# Altium schematic sheet 10 AV-SPDIF.SchDoc
size 420 x 297 mm
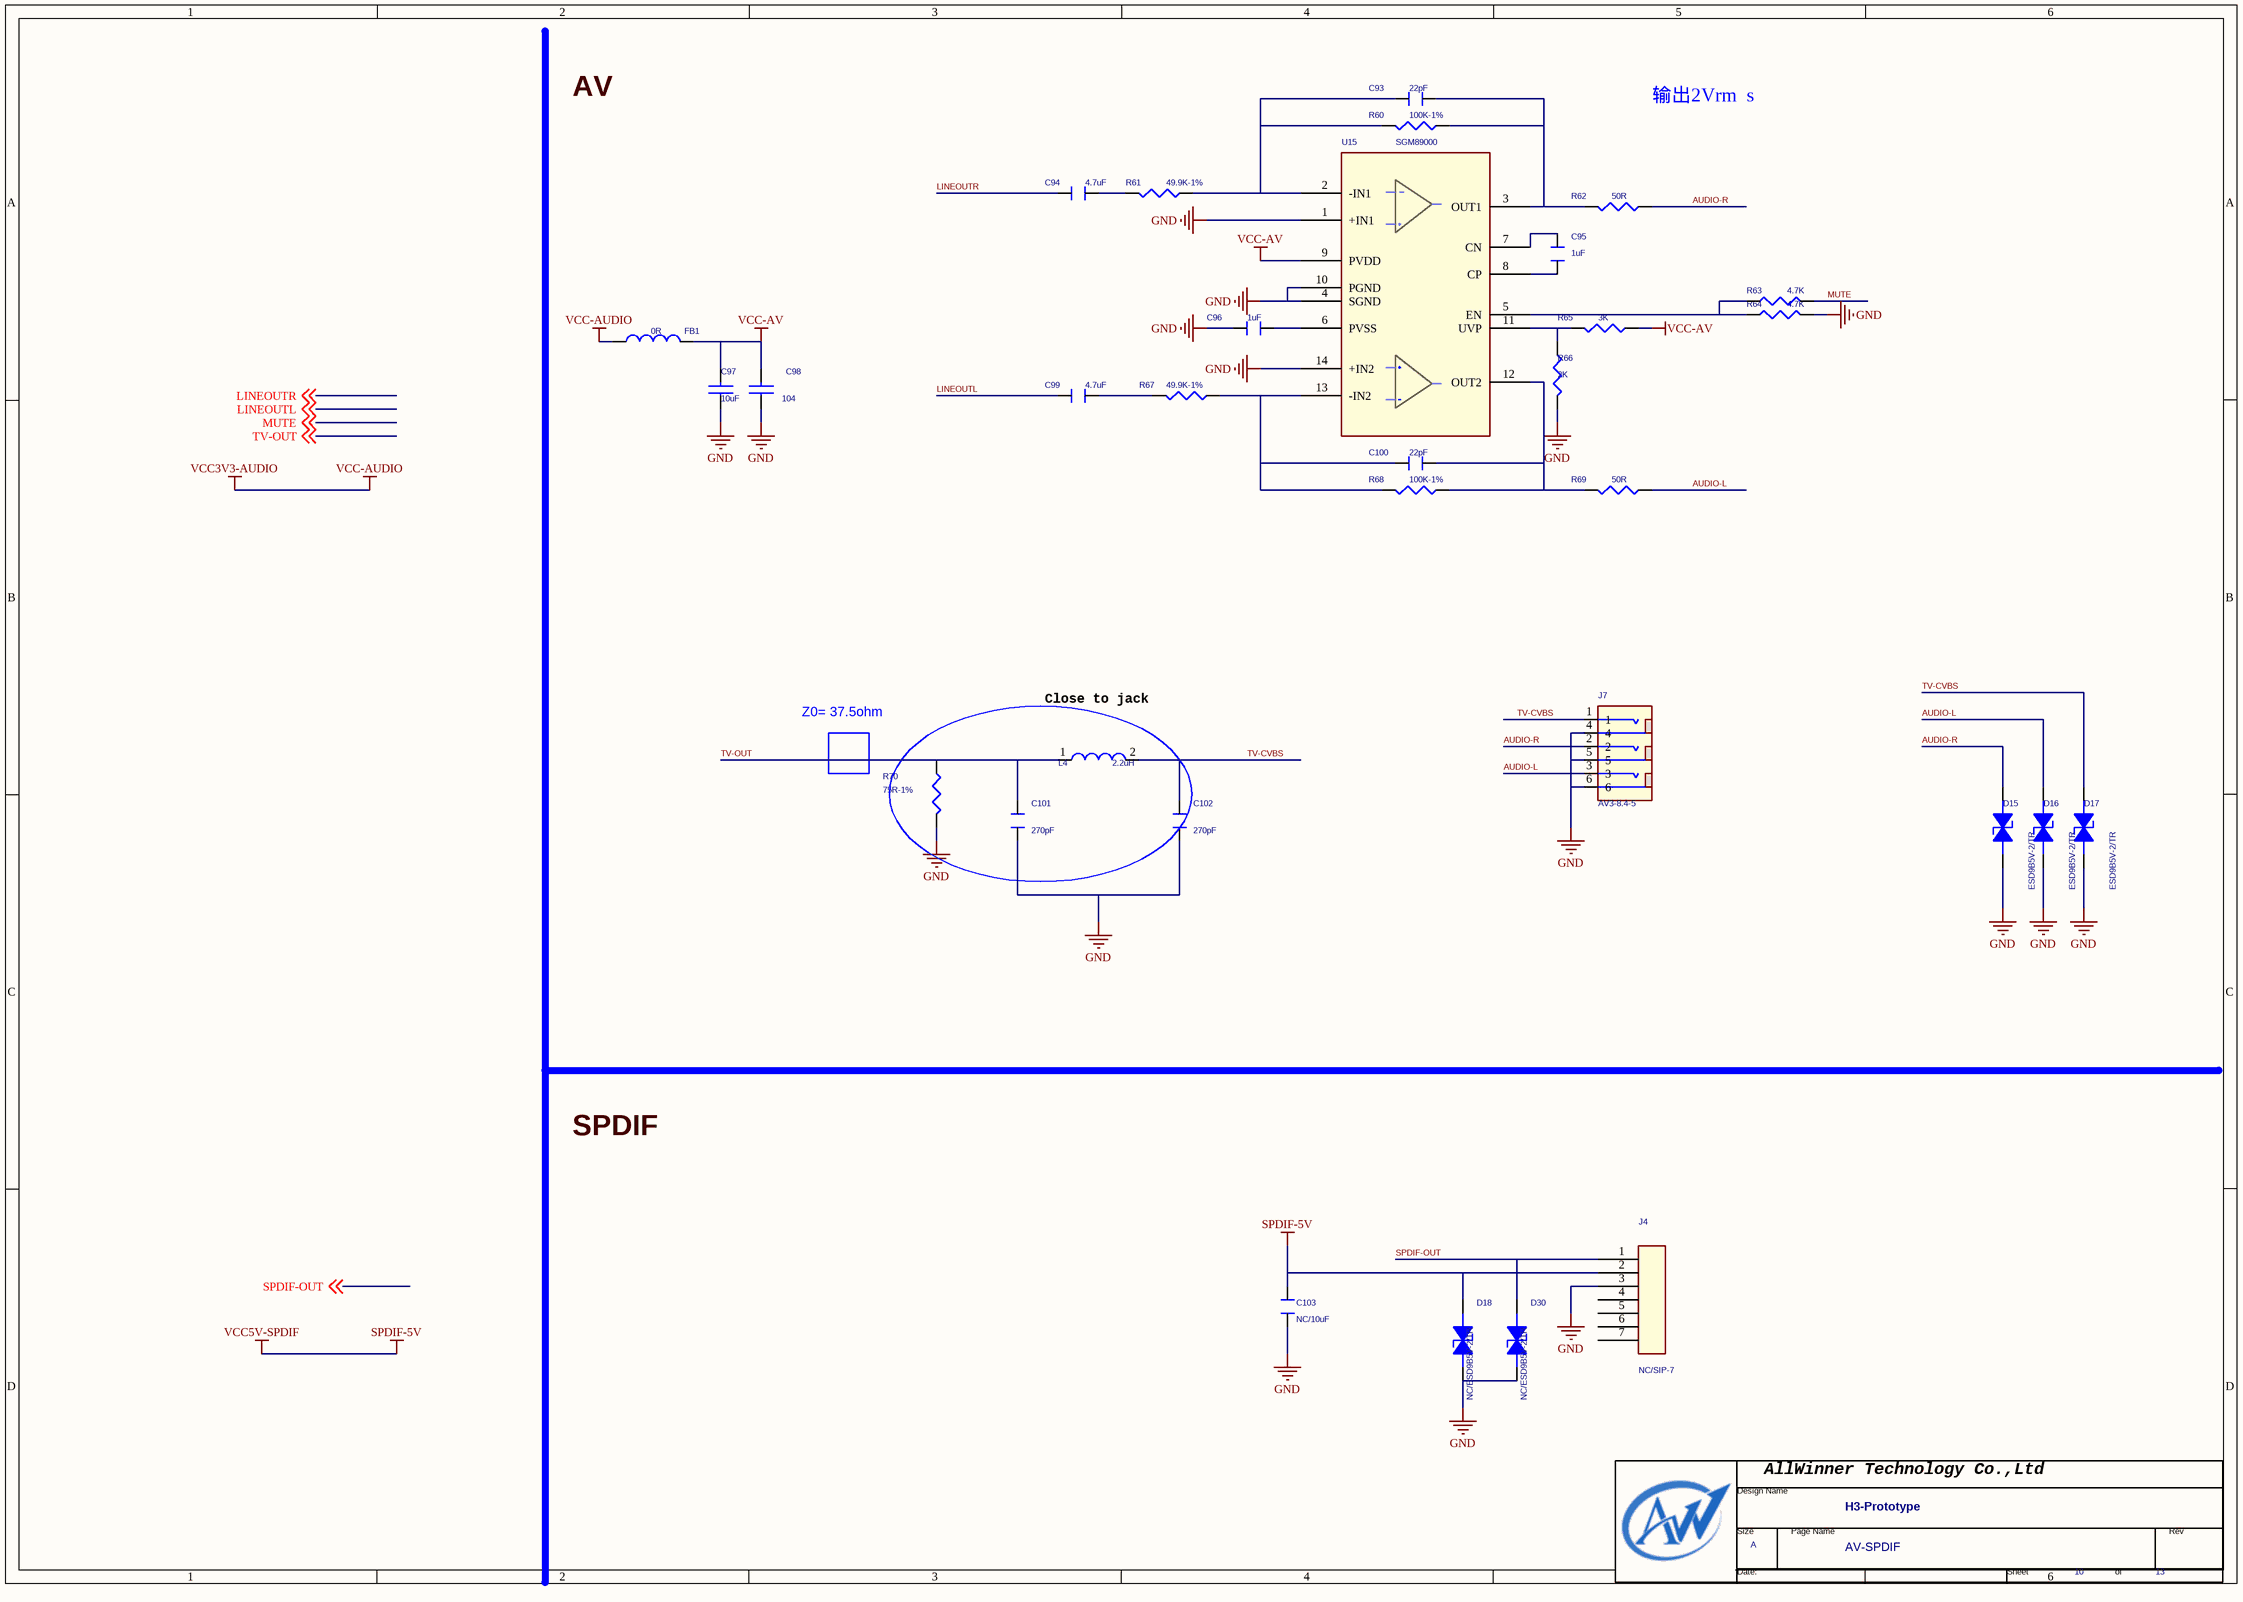
[diagram p0: 10 AV-SPDIF.SchDoc]

## Parts
*  Page Count: 13  Page Number: 10  Page Size: A  Title: H3-Prototype  Doc: AV-SPDIF  (hidden comment: TitleBlock0-AW)  (graphical)
C93  22pF  [C0402]
C94  4.7uF  [C0402]
C95  1uF  [C0402]
C96  1uF  [C0402]
C97  10uF  [C0603]
C98  104  [C0402]
C99  4.7uF  [C0402]
C100  22pF  [C0402]
C101  270pF  [C0402]
C102  270pF  [C0402]
C103  NC/10uF  [C0603]
D15  ESD9B5V-2/TR  [C0402]
D16  ESD9B5V-2/TR  [C0402]
D17  ESD9B5V-2/TR  [C0402]
D18  NC/ESD9B5V-2/TR  [C0402]
D30  NC/ESD9B5V-2/TR  [C0402]
FB1  0R  [0805]
J4  NC/SIP-7  [SIP-7]
J7  AV3-8.4-5  [B2.0V-L4P]
L4  2.2uH  [L0603]
R60  100K-1%  [R0402]
R61  49.9K-1%  [R0402]
R62  50R  [R0402]
R63  4.7K  [0805]
R64  4.7K  [0805]
R65  3K  [R0402]
R66  2K  [R0402]
R67  49.9K-1%  [R0402]
R68  100K-1%  [R0402]
R69  50R  [R0402]
R70  75R-1%  [R0402]
U15  SGM89000  [TSSOP14]

## Nets
GND: C96.2 C97.1 C98.1 C101.1 C102.1 C103.2 D15.1(ANODE) D16.1(ANODE) D17.1(ANODE) D18.2(CATHODE) D30.2(CATHODE) J4.3 J7.4 J7.5 J7.6 R64.1 R66.2 R70.2 U15.1(+IN1) U15.4(SGND) U15.10(PGND) U15.14(+IN2)
SPDIF-5V: C103.1 D18.1(ANODE) J4.2  [also labelled VCC5V-SPDIF]
VCC-AUDIO: FB1.2  [also labelled VCC3V3-AUDIO]
VCC-AV: C97.2 C98.2 FB1.1 R65.1 U15.9(PVDD)
AUDIO-L: D16.2(CATHODE) J7.3 R69.1
AUDIO-R: D15.2(CATHODE) J7.2 R62.1
LINEOUTL: C99.2 ; off-sheet LINEOUTL
LINEOUTR: C94.2 ; off-sheet LINEOUTR
MUTE: R63.1 ; off-sheet MUTE
SPDIF-OUT: D30.1(ANODE) J4.1 ; off-sheet SPDIF-OUT
TV-CVBS: C102.2 D17.2(CATHODE) J7.1 L4.2
TV-OUT: C101.2 L4.1 R70.1 ; off-sheet TV-OUT
NetC93_1: C93.1 R60.1 R62.2 U15.3(OUT1)
NetC93_2: C93.2 R60.2 R61.1 U15.2(-IN1)
NetC94_1: C94.1 R61.2
NetC95_1: C95.1 U15.7(CN)
NetC95_2: C95.2 U15.8(CP)
NetC96_1: C96.1 U15.6(PVSS)
NetC99_1: C99.1 R67.2
NetC100_1: C100.1 R68.1 R69.2 U15.12(OUT2)
NetC100_2: C100.2 R67.1 R68.2 U15.13(-IN2)
NetR63_2: R63.2 R64.2 U15.5(EN)
NetR65_2: R65.2 R66.1 U15.11(UVP)

Not connected (* = marked no-connect by the designer): J4 4 5 6 7

## Notes on the sheet
- AV
- 输出2Vrm  s
- Z0= 37.5ohm
- (near L4) Close to jack
- SPDIF
- (in symbol TitleBlock0-AW) AllWinner Technology Co.,Ltd; Design Name; Size; Page Name; Rev; Date:; Sheet; of

## Library data of the parts
C93 C96 C100 = CAPACITOR: mypage: 13; PAGE: 2
C94 C95 C99 = CAPACITOR: PAGE: 2; mypage: 13
C97 C98 = CAP NP
C101-C103 = CAPACITOR
D15-D18 D30 = 1_1.5KE100A_Dup1: 1ST PART DESCRIPTION: WILL ESD9B5V Bidirection ESD Protection
FB1 = INDUCTOR_4
J4 = SIP-7
J7 = HEADER_1x4-2mm_0
L4 = INDUCTOR
R60-R62 R65-R69 = R_Dup4: mypage: 13
R63 R64 = R1 0805
R70 = RESISTOR_Dup1: ROOM: TVLCD
U15 = SGM8900
* = TitleBlock0-AW: Page Create Date: March  8, 1995